# Altium project RRO26.PrjPcb
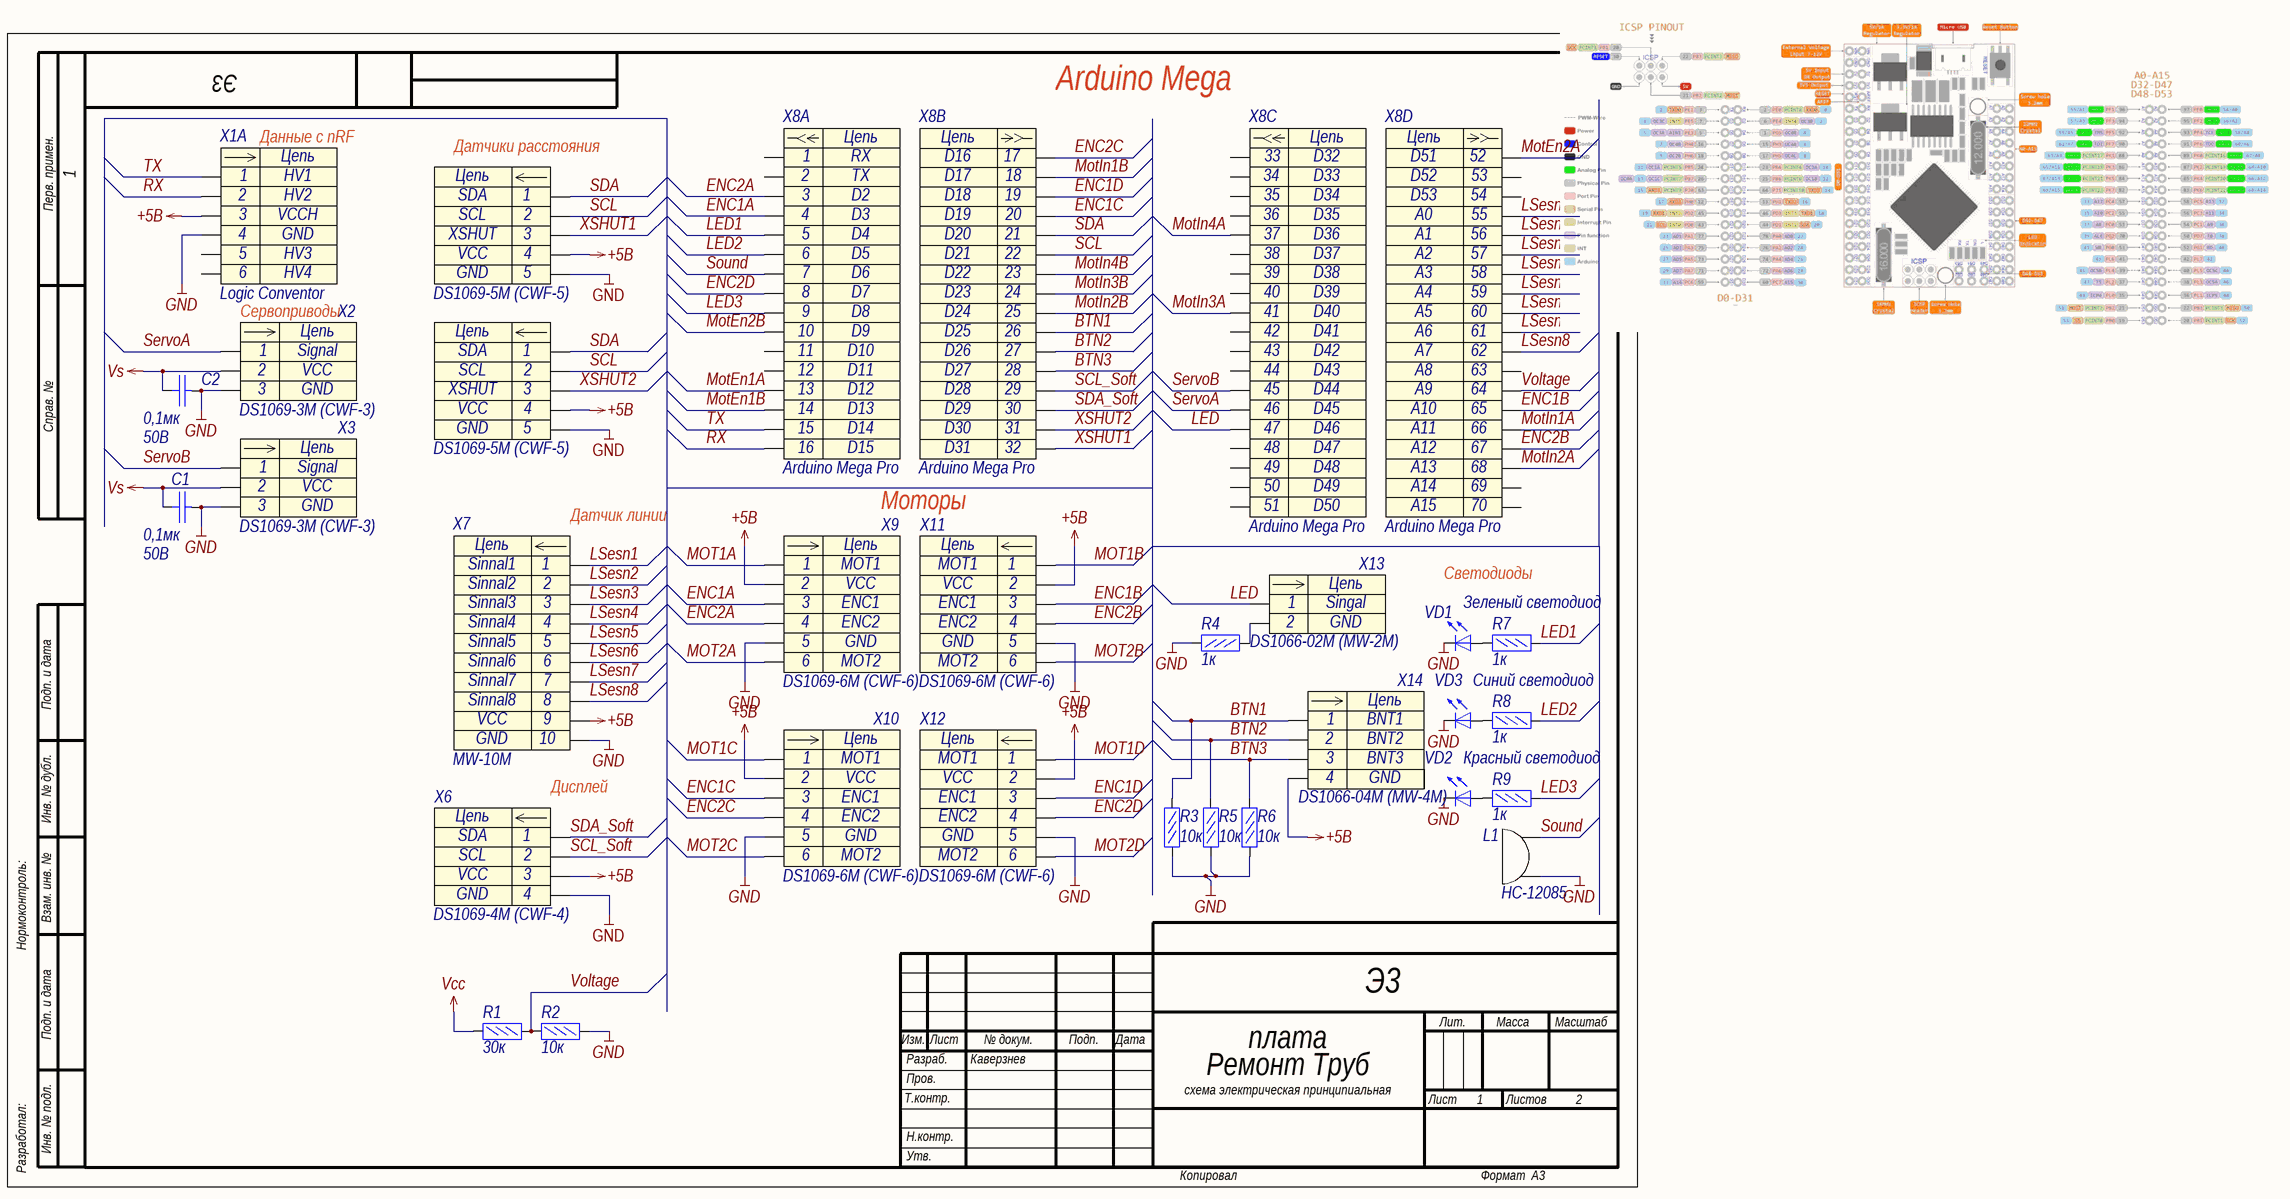
[diagram p0: Э3_1.SchDoc]
2 sheets, 69 parts. Net scope: global (net labels, ports and power ports of the same name join across sheets).
Board file: Плата.PcbDoc
Sheets:
  Э3_1.SchDoc
  Э3_2.SchDoc

## Sheet Э3_1.SchDoc: плата
size 420 x 297 mm; DrawnBy: Каверзнев; DocumentNumber: Э3; SheetNumber: 1; SheetTotal: 2; Title1str: Ремонт Труб; DocumentType: схема электрическая принципиальная; Format: A3; ImagePath: 1

### Parts
C1  Voltage: 50В  [C0603]  (hidden comment: 0,1мк)
C2  Voltage: 50В  [C0603]  (hidden comment: 0,1мк)
L1  HC-12085  [Buzzer]
R1  30к  [R0603]
R2  10к  [R0603]
R3  10к  [R0603]
R4  1к  [R0603]
R5  10к  [R0603]
R6  10к  [R0603]
R7  1к  [R0603]
R8  1к  [R0603]
R9  1к  [R0603]
VD1  Зеленый светодиод  [VD0603]
VD2  Красный светодиод  [VD0603]
VD3  Синий светодиод  [VD0603]
X1  Logic Conventor  [LOGIC CONVENTOR]  (part A of 2)
X2  DS1069-3M (CWF-3)  [CWF-3]
X3  DS1069-3M (CWF-3)  [CWF-3]
X4  DS1069-5M (CWF-5)  [CWF-5]
X5  DS1069-5M (CWF-5)  [CWF-5]
X6  DS1069-4M (CWF-4)  [CWF-4]
X7  MW-10M  [MW-10M]
X8  Arduino Mega Pro  [Arduino Mega Pro Mini]  (parts A,B,C,D of 5)
X9  DS1069-6M (CWF-6)  [CWF-6]
X10  DS1069-6M (CWF-6)  [CWF-6]
X11  DS1069-6M (CWF-6)  [CWF-6]
X12  DS1069-6M (CWF-6)  [CWF-6]
X13  DS1066-02M (MW-2M)  [MW-2M]
X14  DS1066-04M (MW-4M)  [MW-4M]

### Nets
+5B: X1.3 X4.4 X5.4 X6.3 X7.9 X9.2 X10.2 X11.2 X12.2 X14.4
GND: C1.2 C2.2 L1.2 R2.2 R3.1 R4.2 R5.1 R6.1 VD1.2(K) VD2.2(K) VD3.2(K) X1.4 X2.3 X3.3 X4.5 X5.5 X6.4 X7.10 X9.5 X10.5 X11.5 X12.5
Vcc: R1.1
Vs: C1.1 C2.1 X2.2 X3.2
BTN1: R3.2 X8.26 X14.1
BTN2: R5.2 X8.27 X14.2
BTN3: R6.2 X8.28 X14.3
ENC1A: X8.4 X9.3
ENC1B: X8.65 X11.3
ENC1C: X8.20 X10.3
ENC1D: X8.19 X12.3
ENC2A: X8.3 X9.4
ENC2B: X8.67 X11.4
ENC2C: X8.17 X10.4
ENC2D: X8.8 X12.4
LED: X8.47 X13.1
LED1: R7.2 X8.5
LED2: R8.2 X8.6
LED3: R9.2 X8.9
LSesn1: X7.1 X8.55
LSesn2: X7.2 X8.56
LSesn3: X7.3 X8.57
LSesn4: X7.4 X8.58
LSesn5: X7.5 X8.59
LSesn6: X7.6 X8.60
LSesn7: X7.7 X8.61
LSesn8: X7.8 X8.62
MOT1A: X9.1
MOT1B: X11.1
MOT1C: X10.1
MOT1D: X12.1
MOT2A: X9.6
MOT2B: X11.6
MOT2C: X10.6
MOT2D: X12.6
MotEn1A: X8.13
MotEn1B: X8.14
MotEn2A: X8.52
MotEn2B: X8.10
MotIn1A: X8.66
MotIn1B: X8.18
MotIn2A: X8.68
MotIn2B: X8.25
MotIn3A: X8.41
MotIn3B: X8.24
MotIn4A: X8.37
MotIn4B: X8.23
RX: X1.2 X8.16
SCL: X4.2 X5.2 X8.22
SCL_Soft: X6.2 X8.29
SDA: X4.1 X5.1 X8.21
SDA_Soft: X6.1 X8.30
ServoA: X2.1 X8.46
ServoB: X3.1 X8.45
Sound: L1.1 X8.7
TX: X1.1 X8.15
Voltage: R1.2 R2.1 X8.64
XSHUT1: X4.3 X8.32
XSHUT2: X5.3 X8.31
NetR4_1: R4.1 X13.2
NetR7_1: R7.1 VD1.1(A)
NetR8_1: R8.1 VD3.1(A)
NetR9_1: R9.1 VD2.1(A)

Not connected (* = marked no-connect by the designer): X1 5 6; X8 1 2 11 12 33 34 35 36 38 39 40 42 43 44 48 49 50 51 53 54 63 69 70

### Notes on the sheet
- Arduino Mega
- Перв. примен.
- Данные с nRF
- (near X4) Датчики расстояния
- Сервоприводы
- Справ. №
- Моторы
- (near X7) Датчик линии
- Светодиоды
- Подп. и дата
- Инв. № дубл.
- Дисплей
- Нормоконтроль:
- Взам. инв. №
- Изм.
- Лист
- № докум.
- Подп.
- Дата
- Лит.
- Масса
- Масштаб
- Т.контр.
- Пров.
- Разраб.
- 1
- Листов
- 2
- Разработал:
- Инв. № подл.
- Н.контр.
- Утв.
- Копировал
- Формат
- (in symbol CWF-3) Цепь
- (in symbol CWF-4) Цепь
- (in symbol CWF-5) Цепь
- (in symbol CWF-6) Цепь
- (in symbol CWF-10) Цепь
- (in symbol Logic Conventor, part A) Цепь; HV1; HV2; VCCH; GND; HV3; HV4
- (in symbol MW-2M) Цепь
- (in symbol MW-4M) Цепь

### Library data of the parts
C1 C2 = GRM188R71H104KA93D: Конденсатор кер. 0,1мкФ 50В X7R; Manufacturer: Murata; Name: GRM188R71H104KA93D; TKE: X7R; Value: 0,1мк
L1 = HC-12085: Manufacturer: Epcos TDK; Name: HC-12085
R1 = RC0603FR-0730KL: Резистор 30кОм 0,063Вт 1%; Manufacturer: YAGEO; Name: RC0603FR-0730KL; Tolerance: 1%; Value: 30к
R2 R3 R5 R6 = RC0603FR-0710KL: Резистор 10кОм 0,063Вт 1%; Manufacturer: YAGEO; Name: RC0603FR-0710KL; Tolerance: 1%; Value: 10к
R4 R7-R9 = RC0603FR-071KL: Резистор 1кОм 0,063Вт 1%; Manufacturer: YAGEO; Name: RC0603FR-071KL; Tolerance: 1%; Value: 1к
VD1 = FYLS-0603BUGC: Светодтод зеленый SMD Foryard Optoelectronics Co.; Name: Зеленый светодиод
VD2 = FYLS-0603BURC: Светодтод красный SMD Foryard Optoelectronics Co.; Name: Красный светодиод
VD3 = FYLS-0603BUBC: Светодтод синий SMD Foryard Optoelectronics Co.; Name: Синий светодиод
X1 = Logic Conventor: Преобразователь уровней; Name: Logic Conventor
X2 X3 = CWF-3: Разъем - 3 конт. прямая вилка на плату; Contact_1: Signal; Contact_2: VCC; Contact_3: GND; Name: DS1069-3M (CWF-3)
X4 X5 = CWF-5: Разъем - 5 конт. прямая вилка на плату; Contact_1: SDA; Contact_2: SCL; Contact_3: XSHUT; Contact_4: VCC; Contact_5: GND; Contact_6: Contact_6; Name: DS1069-5M (CWF-5)
X6 = CWF-4: Разъем - 4 конт. прямая вилка на плату; Contact_1: SDA; Contact_2: SCL; Contact_3: VCC; Contact_4: GND; Name: DS1069-4M (CWF-4)
X7 = CWF-10: Contact_1: Sinnal1; Contact_2: Sinnal2; Contact_3: Sinnal3; Contact_4: Sinnal4; Contact_5: Sinnal5; Contact_6: Sinnal6; Contact_7: Sinnal7; Contact_8: Sinnal8; Contact_9: VCC; Contact_10: GND; Name: MW-10M
X8 = Arduino Mega Pro Mini: Name: Arduino Mega Pro
X9-X12 = CWF-6: Разъем - 6 конт. прямая вилка на плату; Contact_1: MOT1; Contact_2: VCC; Contact_3: ENC1; Contact_4: ENC2; Contact_5: GND; Contact_6: MOT2; Name: DS1069-6M (CWF-6)
X13 = MW-2M: Разъем - 2 конт. прямая вилка на плату; Contact_1: Singal; Contact_2: GND; Name: DS1066-02M (MW-2M)
X14 = MW-4M: Разъем - 4 конт. прямая вилка на плату; Contact_1: BNT1; Contact_2: BNT2; Contact_3: BNT3; Contact_4: GND; Name: DS1066-04M (MW-4M)

## Sheet Э3_2.SchDoc: плата
size 420 x 297 mm; DrawnBy: Каверзнев; DocumentNumber: Ремонт Труб; Revision: 1; SheetNumber: 2; SheetTotal: 2; Format: A3
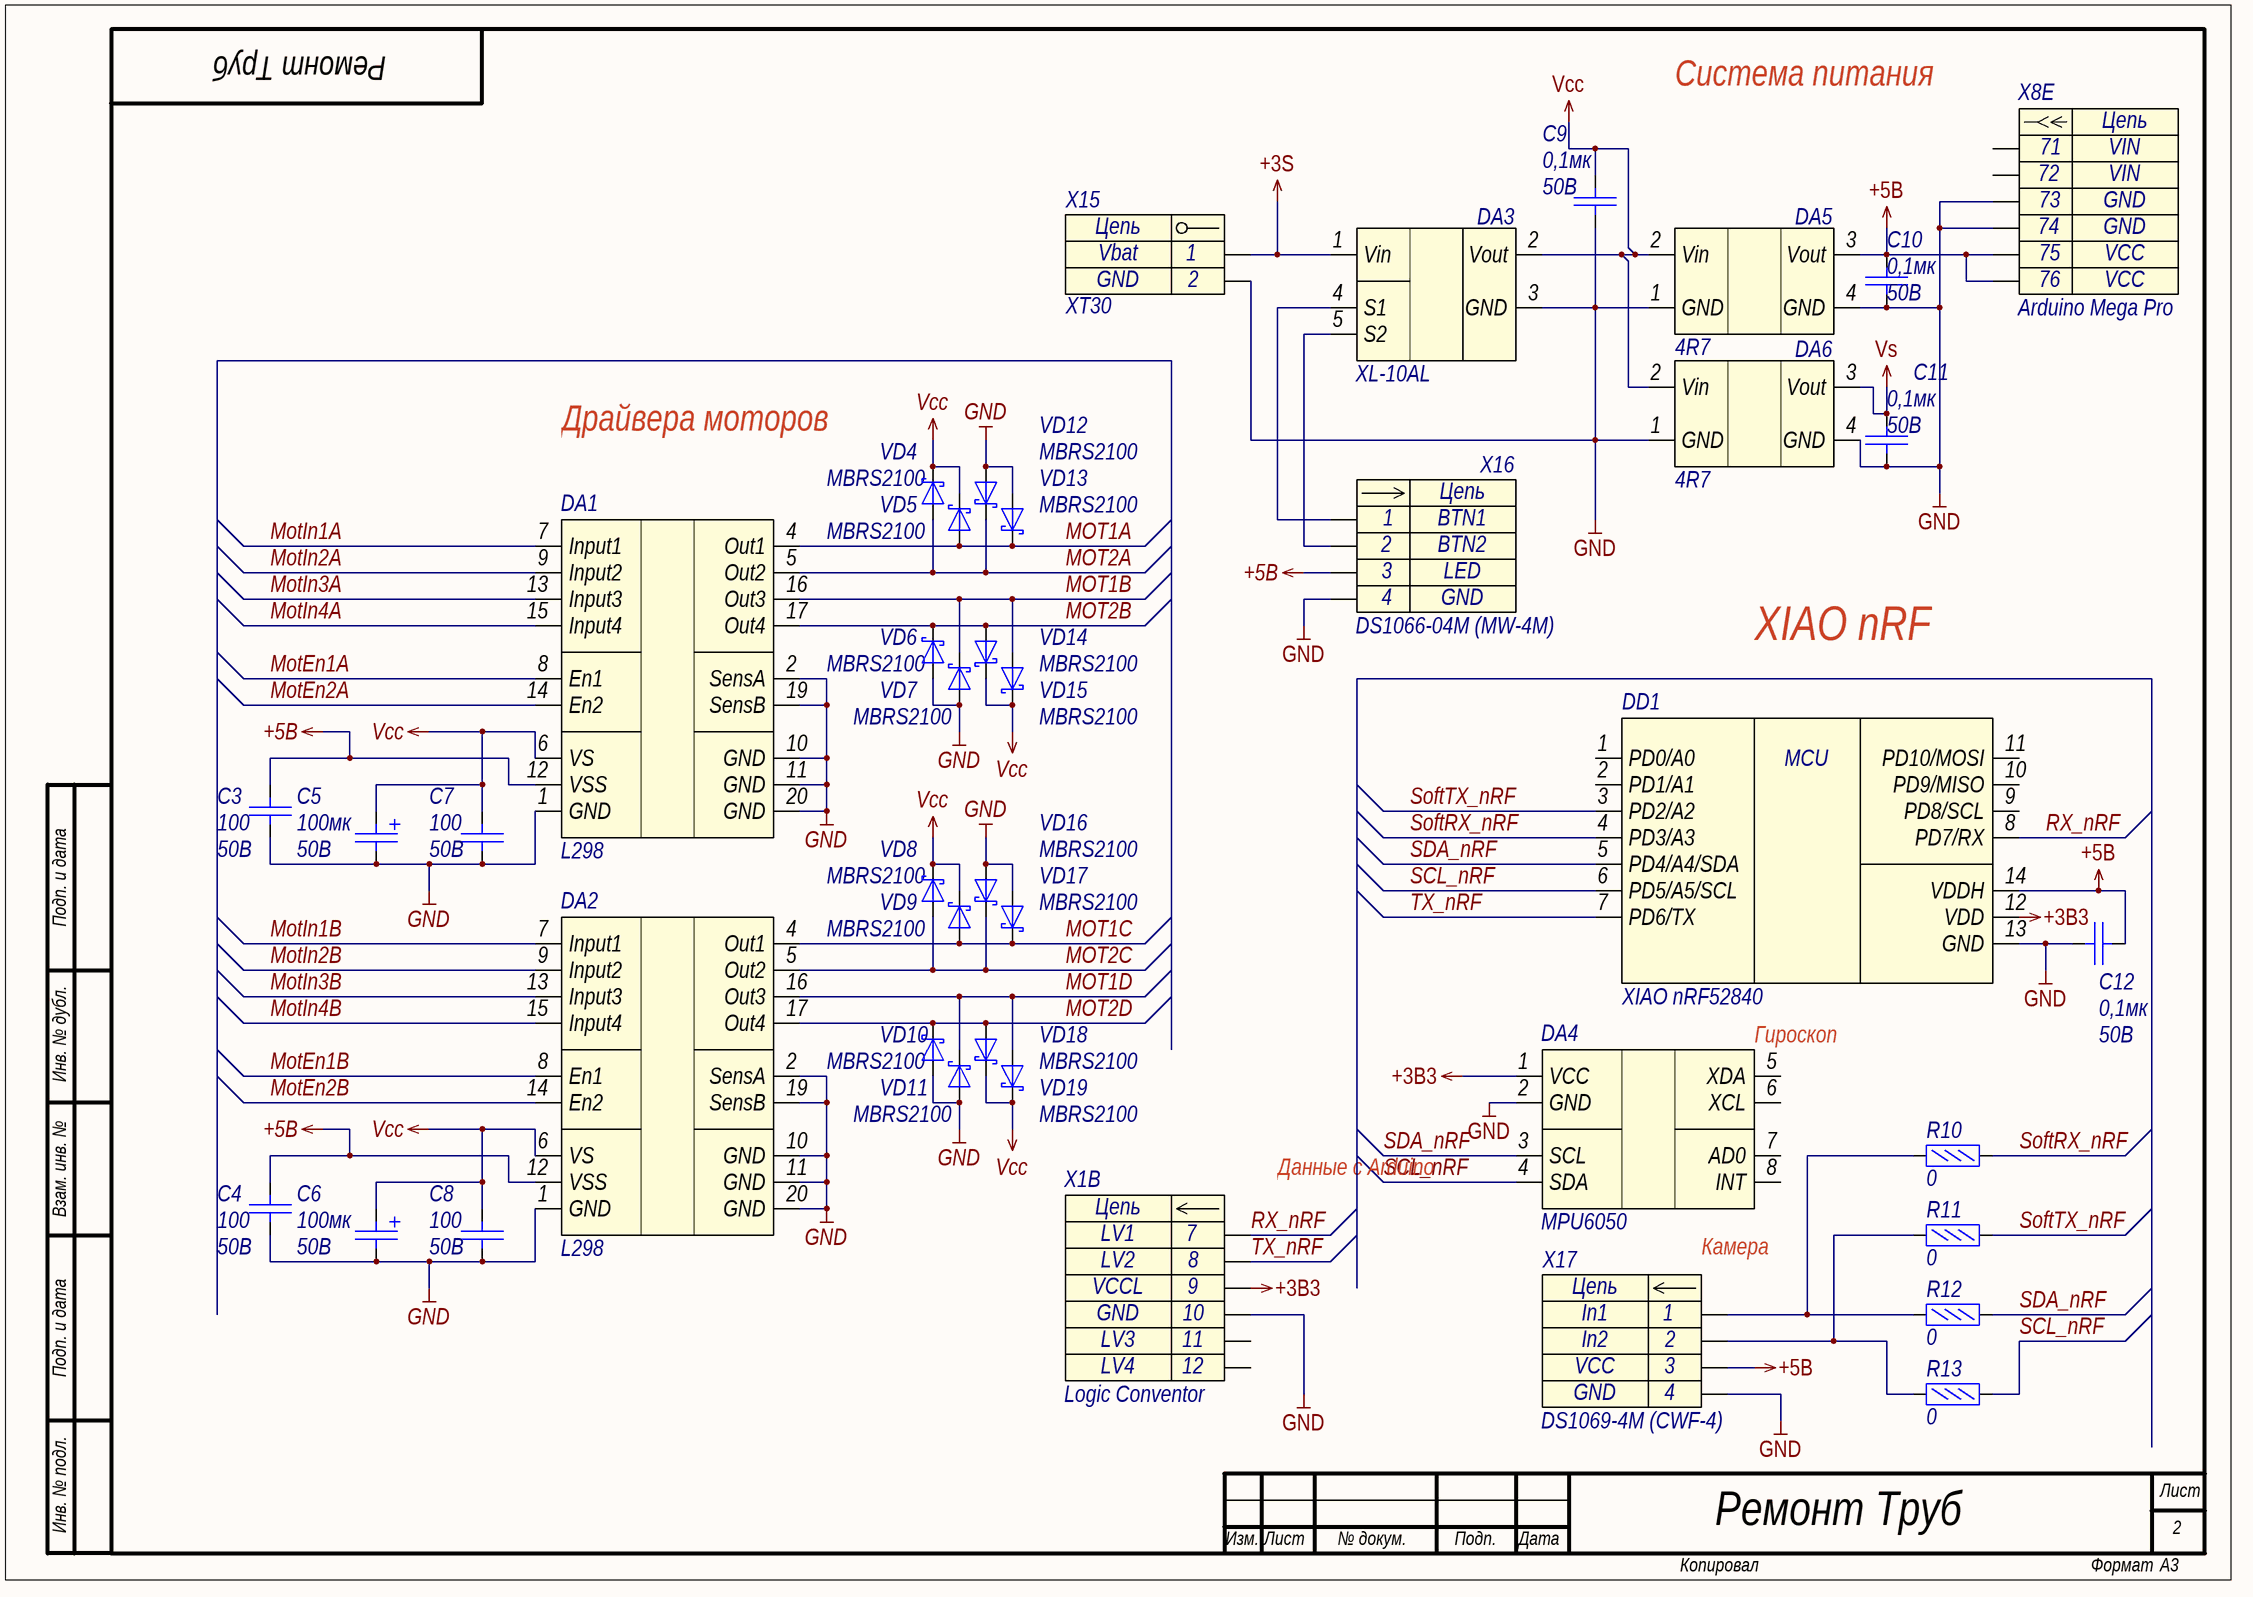
[diagram p1: Э3_2.SchDoc]

### Parts
C3  Voltage: 50В  [C0603]  (hidden comment: 100)
C4  Voltage: 50В  [C0603]  (hidden comment: 100)
C5  Voltage: 50В  [CAPALUM_8x11.5_V]  (hidden comment: 100мк)
C6  Voltage: 50В  [CAPALUM_8x11.5_V]  (hidden comment: 100мк)
C7  Voltage: 50В  [C0603]  (hidden comment: 100)
C8  Voltage: 50В  [C0603]  (hidden comment: 100)
C9  Voltage: 50В  [C0603]  (hidden comment: 0,1мк)
C10  Voltage: 50В  [C0603]  (hidden comment: 0,1мк)
C11  Voltage: 50В  [C0603]  (hidden comment: 0,1мк)
C12  Voltage: 50В  [C0603]  (hidden comment: 0,1мк)
DA1  L298  [L298P]
DA2  L298  [L298P]
DA3  XL-10AL  [XL-10AL]
DA4  MPU6050  [MPU6050]
DA5  4R7  [mini360]
DA6  4R7  [mini360]
DD1  XIAO nRF52840  [Seeed Studio XIAO nRF52840]
R10  0  [R0603]
R11  0  [R0603]
R12  0  [R0603]
R13  0  [R0603]
VD4  MBRS2100  [DO-214AA]
VD5  MBRS2100  [DO-214AA]
VD6  MBRS2100  [DO-214AA]
VD7  MBRS2100  [DO-214AA]
VD8  MBRS2100  [DO-214AA]
VD9  MBRS2100  [DO-214AA]
VD10  MBRS2100  [DO-214AA]
VD11  MBRS2100  [DO-214AA]
VD12  MBRS2100  [DO-214AA]
VD13  MBRS2100  [DO-214AA]
VD14  MBRS2100  [DO-214AA]
VD15  MBRS2100  [DO-214AA]
VD16  MBRS2100  [DO-214AA]
VD17  MBRS2100  [DO-214AA]
VD18  MBRS2100  [DO-214AA]
VD19  MBRS2100  [DO-214AA]
X1  Logic Conventor  [LOGIC CONVENTOR]  (part B of 2)
X8  Arduino Mega Pro  [Arduino Mega Pro Mini]  (part E of 5)
X15  XT30  [XT30 - duplicate]
X16  DS1066-04M (MW-4M)  [MW-4M]
X17  DS1069-4M (CWF-4)  [CWF-4]

### Nets
+3B3: DA4.1(VCC) DD1.12(VDD) X1.9
+3S: DA3.1(Vin) X15.1
+5B: C3.1 C4.1 C10.2 C12.2 DA1.12(VSS) DA2.12(VSS) DA5.3(Vout) DD1.14(VDDH) X8.75 X8.76 X16.3 X17.3
GND: C3.2 C4.2 C5.2 C6.2 C7.1 C8.1 C9.1 C10.1 C11.1 C12.1 DA1.1(GND) DA1.2(SensA) DA1.10(GND) DA1.11(GND) DA1.19(SensB) DA1.20(GND) DA2.1(GND) DA2.2(SensA) DA2.10(GND) DA2.11(GND) DA2.19(SensB) DA2.20(GND) DA3.3(GND) DA4.2(GND) DA5.1(GND) DA5.4(GND) DA6.1(GND) DA6.4(GND) DD1.13(GND) VD6.2(A) VD7.2(A) VD10.2(A) VD11.2(A) VD12.2(A) VD13.2(A) VD16.2(A) VD17.2(A) X1.10 X8.73 X8.74 X15.2 X16.4 X17.4
Vcc: C5.1 C6.1 C7.2 C8.2 C9.2 DA1.6(VS) DA2.6(VS) DA3.2(Vout) DA5.2(Vin) DA6.2(Vin) VD4.1(K) VD5.1(K) VD8.1(K) VD9.1(K) VD14.1(K) VD15.1(K) VD18.1(K) VD19.1(K)
Vs: C11.2 DA6.3(Vout)
MOT1A: DA1.4(Out1) VD5.2(A) VD13.1(K)
MOT1B: DA1.16(Out3) VD7.1(K) VD15.2(A)
MOT1C: DA2.4(Out1) VD9.2(A) VD17.1(K)
MOT1D: DA2.16(Out3) VD11.1(K) VD19.2(A)
MOT2A: DA1.5(Out2) VD4.2(A) VD12.1(K)
MOT2B: DA1.17(Out4) VD6.1(K) VD14.2(A)
MOT2C: DA2.5(Out2) VD8.2(A) VD16.1(K)
MOT2D: DA2.17(Out4) VD10.1(K) VD18.2(A)
MotEn1A: DA1.8(En1)
MotEn1B: DA2.8(En1)
MotEn2A: DA1.14(En2)
MotEn2B: DA2.14(En2)
MotIn1A: DA1.7(Input1)
MotIn1B: DA2.7(Input1)
MotIn2A: DA1.9(Input2)
MotIn2B: DA2.9(Input2)
MotIn3A: DA1.13(Input3)
MotIn3B: DA2.13(Input3)
MotIn4A: DA1.15(Input4)
MotIn4B: DA2.15(Input4)
RX_nRF: DD1.8(PD7/RX) X1.7
SCL_nRF: DA4.4(SDA) DD1.6(PD5/A5/SCL) R13.2
SDA_nRF: DA4.3(SCL) DD1.5(PD4/A4/SDA) R12.2
SoftRX_nRF: DD1.4(PD3/A3) R10.2
SoftTX_nRF: DD1.3(PD2/A2) R11.2
TX_nRF: DD1.7(PD6/TX) X1.8
NetDA3_4: DA3.4(S1) X16.1
NetDA3_5: DA3.5(S2) X16.2
NetR10_1: R10.1 R12.1 X17.1
NetR11_1: R11.1 R13.1 X17.2

Not connected (* = marked no-connect by the designer): DA4 5(XDA) 6(XCL) 7(AD0) 8(INT); DD1 1(PD0/A0) 2(PD1/A1) 9(PD8/SCL) 10(PD9/MISO) 11(PD10/MOSI); X1 11 12; X8 71 72

### Notes on the sheet
- Система питания
- Драйвера моторов
- XIAO nRF
- Подп. и дата
- Инв. № дубл.
- (near DA4) Гироскоп
- Взам. инв. №
- (near X1) Данные с Arduino
- Камера
- Инв. № подл.
- Лист
- 2
- Изм.
- № докум.
- Подп.
- Дата
- Копировал
- Формат
- (in symbol Arduino Mega Pro Mini, part E) Цепь; VIN; GND; VCC
- (in symbol CWF-4) Цепь
- (in symbol Logic Conventor, part B) Цепь; LV1; LV2; VCCL; GND; LV3; LV4
- (in symbol MW-4M) Цепь
- (in symbol XIAO nRF52840) MCU
- (in symbol XT30) Цепь

### Library data of the parts
C3 C4 C7 C8 = CC0603JRNPO9BN101: Конденсатор кер. 100пФ 50В; Manufacturer: Yageo; TKE: NP0; Name: CC0603JRNPO9BN101; Value: 100
C5 C6 = B41858C6107M: Конденсатор эл.лит. алюм. 100мкФ 50В; Manufacturer: EPCOS; ESR: 0,6Ом; Name: B41858C6107; Value: 100мк
C9-C12 = GRM188R71H104KA93D: as C1 on sheet Э3_1; Name: GRM188R71H104KA93D; TKE: X7R; Value: 0,1мк
DA1 DA2 = L298: Драйвер двигателя; Manufacturer: China; Name: L298
DA3 = XL-10AL: Manufacturer: China; Name: XL-10AL
DA4 = MPU6050: Гироскоп и акселерометр; Manufacturer: China; Name: MPU6050
DA5 DA6 = 4R7: Линейный стабилизатор напряжения 14.4В -> 5В; Manufacturer: China; Name: 4R7
DD1 = XIAO nRF52840: Микроконтроллер nRF52840; Name: XIAO nRF52840; HelpURL: https://wiki.seeedstudio.com/XIAO_BLE/#hardware-overview
R10-R13 = Перемычка 0603: Name: Перемычка 0603; Value: 0
VD4-VD19 = MBRS2100: Диод Шоттки 100В 2А; Name: MBRS2100
X1 = Logic Conventor: Преобразователь уровней; Name: Logic Conventor
X8 = Arduino Mega Pro Mini: Name: Arduino Mega Pro
X15 = XT30: Contact_1: Vbat; Contact_2: GND; Name: XT30
X16 = MW-4M: Разъем - 4 конт. прямая вилка на плату; Contact_1: BTN1; Contact_2: BTN2; Contact_3: LED; Contact_4: GND; Name: DS1066-04M (MW-4M)
X17 = CWF-4: Разъем - 4 конт. прямая вилка на плату; Contact_1: In1; Contact_2: In2; Contact_3: VCC; Contact_4: GND; Name: DS1069-4M (CWF-4)

## Nets that join several sheets
+5B: Э3_1 (10 pins), Э3_2 (12 pins)
GND: Э3_1 (22 pins), Э3_2 (43 pins)
Vcc: Э3_1 (R1.1), Э3_2 (18 pins)
Vs: Э3_1 (C1.1 C2.1 X2.2 X3.2), Э3_2 (C11.2 DA6.3)
MOT1A: Э3_1 (X9.1), Э3_2 (DA1.4 VD5.2 VD13.1)
MOT1B: Э3_1 (X11.1), Э3_2 (DA1.16 VD7.1 VD15.2)
MOT1C: Э3_1 (X10.1), Э3_2 (DA2.4 VD9.2 VD17.1)
MOT1D: Э3_1 (X12.1), Э3_2 (DA2.16 VD11.1 VD19.2)
MOT2A: Э3_1 (X9.6), Э3_2 (DA1.5 VD4.2 VD12.1)
MOT2B: Э3_1 (X11.6), Э3_2 (DA1.17 VD6.1 VD14.2)
MOT2C: Э3_1 (X10.6), Э3_2 (DA2.5 VD8.2 VD16.1)
MOT2D: Э3_1 (X12.6), Э3_2 (DA2.17 VD10.1 VD18.2)
MotEn1A: Э3_1 (X8.13), Э3_2 (DA1.8)
MotEn1B: Э3_1 (X8.14), Э3_2 (DA2.8)
MotEn2A: Э3_1 (X8.52), Э3_2 (DA1.14)
MotEn2B: Э3_1 (X8.10), Э3_2 (DA2.14)
MotIn1A: Э3_1 (X8.66), Э3_2 (DA1.7)
MotIn1B: Э3_1 (X8.18), Э3_2 (DA2.7)
MotIn2A: Э3_1 (X8.68), Э3_2 (DA1.9)
MotIn2B: Э3_1 (X8.25), Э3_2 (DA2.9)
MotIn3A: Э3_1 (X8.41), Э3_2 (DA1.13)
MotIn3B: Э3_1 (X8.24), Э3_2 (DA2.13)
MotIn4A: Э3_1 (X8.37), Э3_2 (DA1.15)
MotIn4B: Э3_1 (X8.23), Э3_2 (DA2.15)